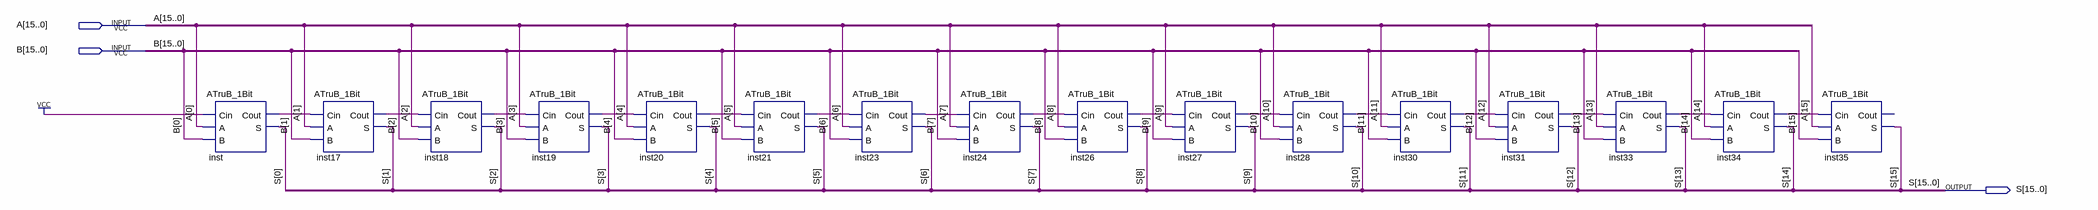
[diagram p0: schematic sheet]
// Quartus schematic ATruB_16Bit.bdf as structural Verilog: 16 symbols, 3 pins
module ATruB_16Bit (
  input  [15:0] A,
  input  [15:0] B,
  output [15:0] S
);

  wire inst17_cout, inst18_cout, inst19_cout, inst20_cout, inst21_cout, inst23_cout, inst24_cout,
       inst26_cout, inst27_cout, inst28_cout, inst30_cout, inst31_cout, inst33_cout, inst34_cout, inst_cout;

  ATruB_1Bit inst (.Cin(1'b1), .A(A[0]), .B(B[0]), .Cout(inst_cout), .S(S[0]));
  ATruB_1Bit inst17 (.Cin(inst_cout), .A(A[1]), .B(B[1]), .Cout(inst17_cout), .S(S[1]));
  ATruB_1Bit inst18 (.Cin(inst17_cout), .A(A[2]), .B(B[2]), .Cout(inst18_cout), .S(S[2]));
  ATruB_1Bit inst19 (.Cin(inst18_cout), .A(A[3]), .B(B[3]), .Cout(inst19_cout), .S(S[3]));
  ATruB_1Bit inst20 (.Cin(inst19_cout), .A(A[4]), .B(B[4]), .Cout(inst20_cout), .S(S[4]));
  ATruB_1Bit inst21 (.Cin(inst20_cout), .A(A[5]), .B(B[5]), .Cout(inst21_cout), .S(S[5]));
  ATruB_1Bit inst23 (.Cin(inst21_cout), .A(A[6]), .B(B[6]), .Cout(inst23_cout), .S(S[6]));
  ATruB_1Bit inst24 (.Cin(inst23_cout), .A(A[7]), .B(B[7]), .Cout(inst24_cout), .S(S[7]));
  ATruB_1Bit inst26 (.Cin(inst24_cout), .A(A[8]), .B(B[8]), .Cout(inst26_cout), .S(S[8]));
  ATruB_1Bit inst27 (.Cin(inst26_cout), .A(A[9]), .B(B[9]), .Cout(inst27_cout), .S(S[9]));
  ATruB_1Bit inst28 (.Cin(inst27_cout), .A(A[10]), .B(B[10]), .Cout(inst28_cout), .S(S[10]));
  ATruB_1Bit inst30 (.Cin(inst28_cout), .A(A[11]), .B(B[11]), .Cout(inst30_cout), .S(S[11]));
  ATruB_1Bit inst31 (.Cin(inst30_cout), .A(A[12]), .B(B[12]), .Cout(inst31_cout), .S(S[12]));
  ATruB_1Bit inst33 (.Cin(inst31_cout), .A(A[13]), .B(B[13]), .Cout(inst33_cout), .S(S[13]));
  ATruB_1Bit inst34 (.Cin(inst33_cout), .A(A[14]), .B(B[14]), .Cout(inst34_cout), .S(S[14]));
  ATruB_1Bit inst35 (.Cin(inst34_cout), .A(A[15]), .B(B[15]), .S(S[15]));  // open: Cout
endmodule
